# EAGLE design 9axis_ToF (EAGLE 9.7.0)
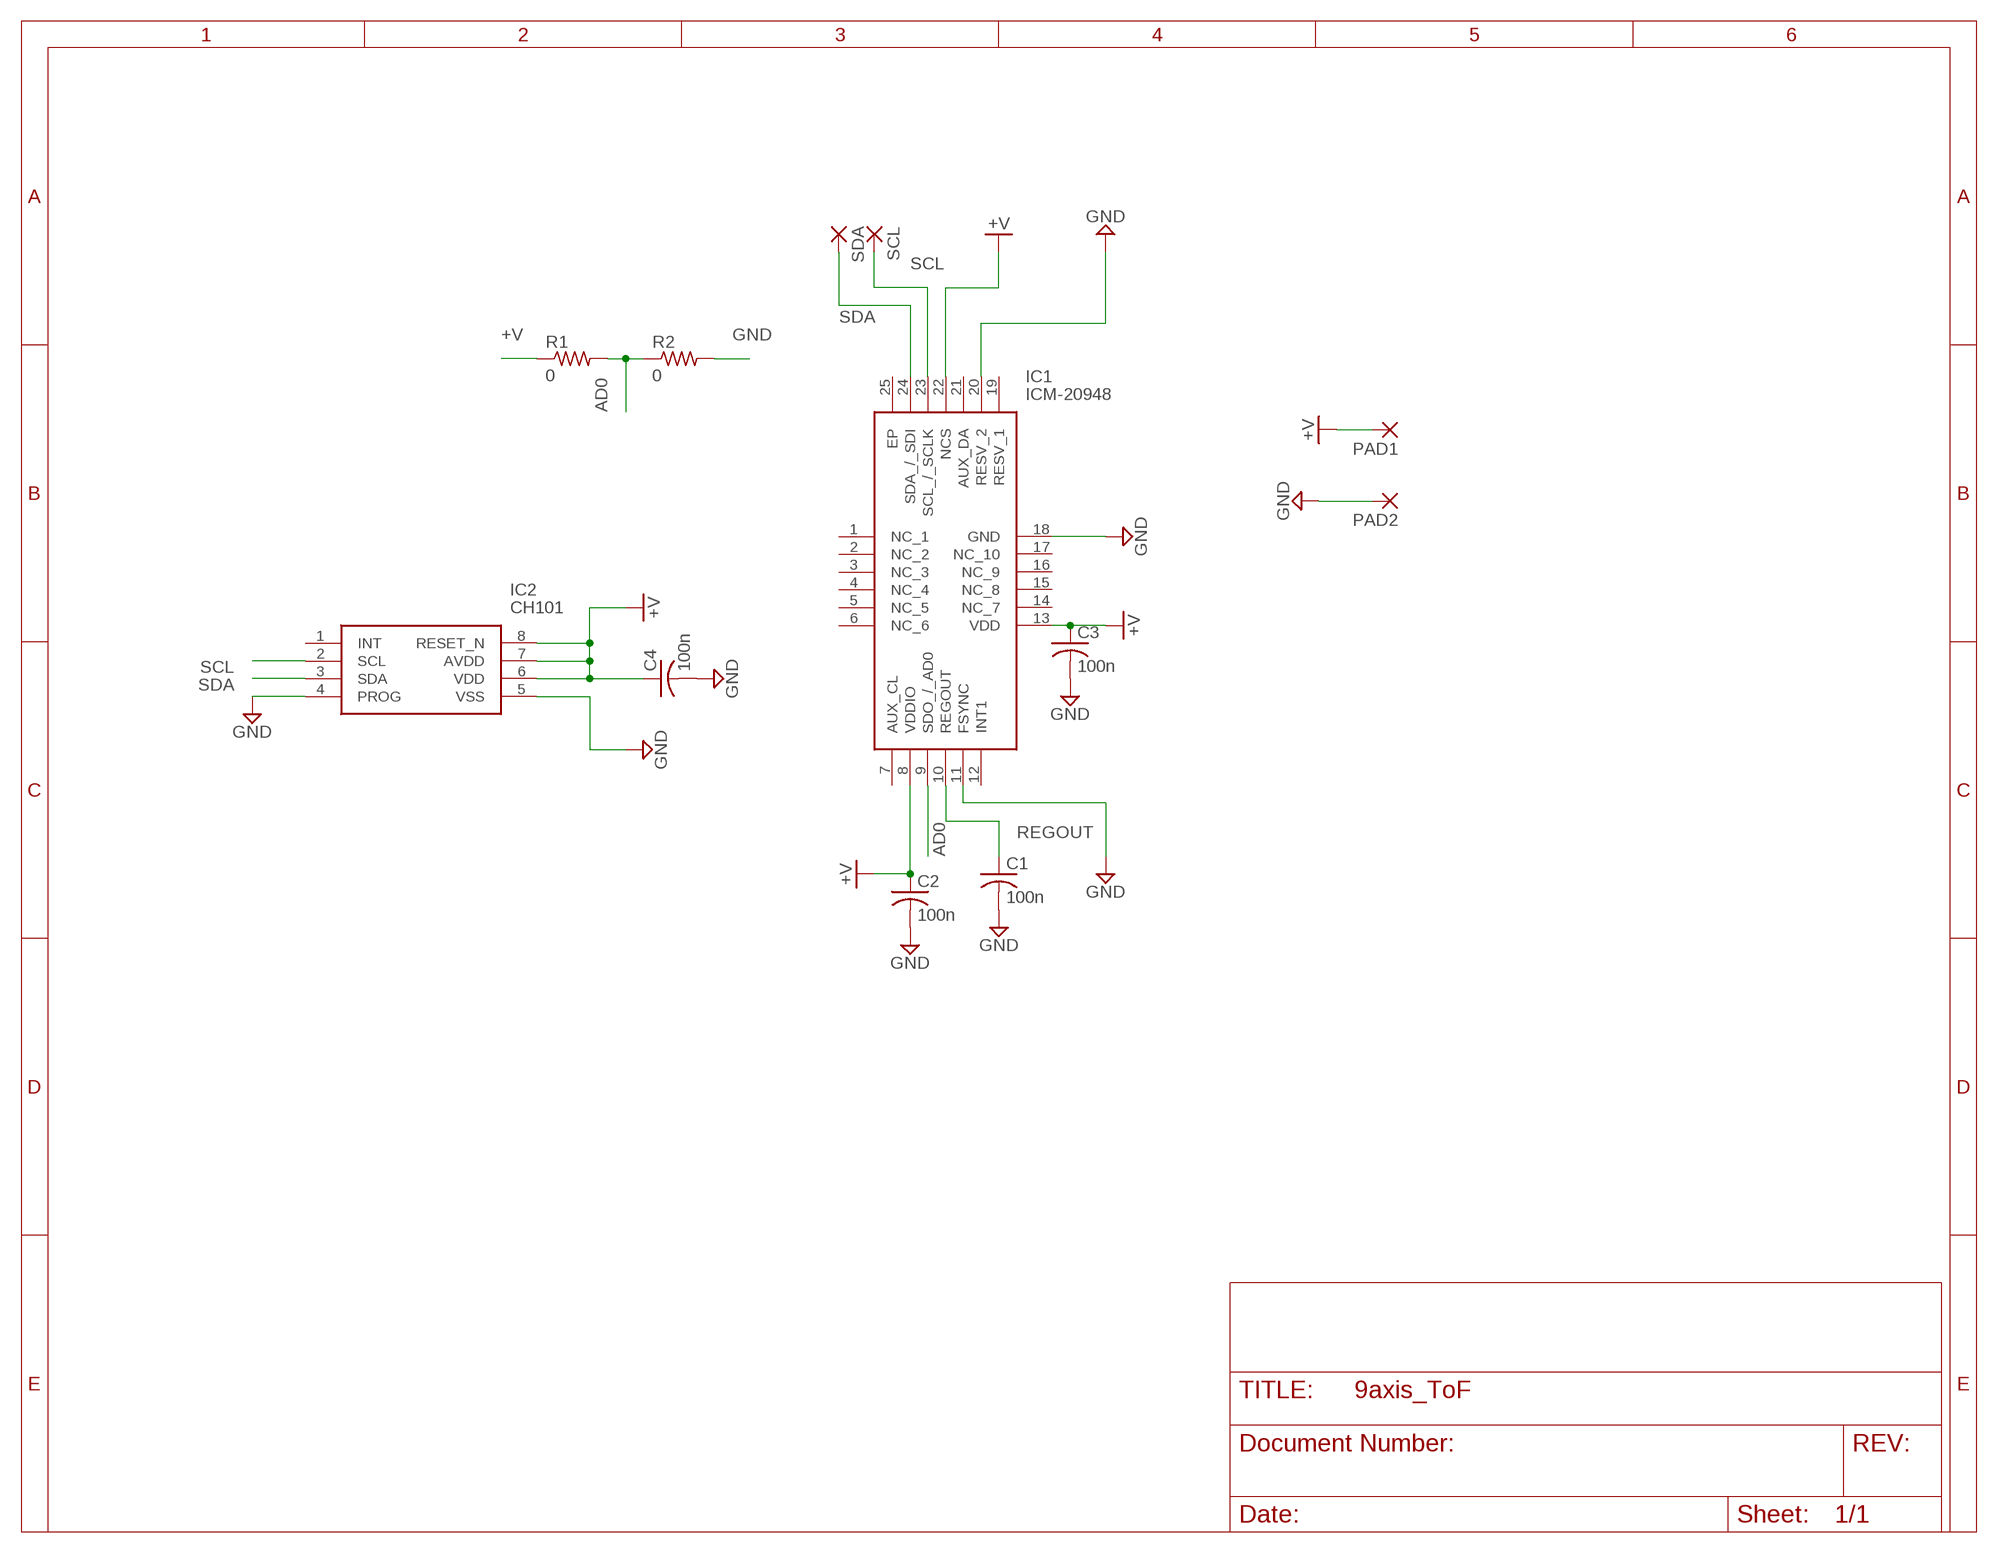
[diagram p0: schematic, sheet 1]

## Parts
C1  100n  C-USC0603  [C0603]
C2  100n  C-USC0603  [C0603]
C3  100n  C-USC0603  [C0603]
C4  100n  C-USC0603  [C0603]
IC1  ICM-20948  [QFN40P300X300X105-25N]
IC2  CH101  [CH101]
PAD1  SMD5  [SMD2,54-5,08]
PAD2  SMD5  [SMD2,54-5,08]
R1  0  R-US_R0603  [R0603]
R2  0  R-US_R0603  [R0603]
SCL  SMD5  [SMD2,54-5,08]
SDA  SMD5  [SMD2,54-5,08]

## Nets
+V [VDD]: C2.1 C3.1 C4.1 IC1.8(VDDIO) IC1.13(VDD) IC1.22(NCS) IC2.6(VDD) IC2.7(AVDD) IC2.8(RESET_N) PAD1.1(P) R1.1
AD0: IC1.9(SDO_/_AD0) R1.2 R2.1
GND [GND]: C1.2 C2.2 C3.2 C4.2 IC1.11(FSYNC) IC1.18(GND) IC1.20(RESV_2) IC2.4(PROG) IC2.5(VSS) PAD2.1(P) R2.2
REGOUT: C1.1 IC1.10(REGOUT)
SCL: IC1.23(SCL_/_SCLK) IC2.2(SCL) SCL.1(P)
SDA: IC1.24(SDA_/_SDI) IC2.3(SDA) SDA.1(P)
Unconnected: IC1.1(NC_1) IC1.2(NC_2) IC1.3(NC_3) IC1.4(NC_4) IC1.5(NC_5) IC1.6(NC_6) IC1.7(AUX_CL) IC1.12(INT1) IC1.14(NC_7) IC1.15(NC_8) IC1.16(NC_9) IC1.17(NC_10) IC1.19(RESV_1) IC1.21(AUX_DA) IC1.25(EP) IC2.1(INT)

## Library data of the parts
C1-C4 = rcl:C-US: CAPACITOR, American symbol; SPICEPREFIX: C
IC1 = ICM-20948:ICM-20948: IMUs - Inertial Measurement Units World's Lowest Power 9-Axis MEMS MotionTracking Device Source: Datasheet <https://product.tdk.com/system/files/dam/doc/product/sensor/mortion-inertial/imu/data_sheet/ds-000189-icm-20948-v1.3.pdf>; ARROW_PART_NUMBER: ICM-20948; ARROW_PRICE-STOCK: https://www.arrow.com/en/products/icm-20948/invensense?region=nac; DESCRIPTION: IMUs - Inertial Measurement Units World's Lowest Power 9-Axis MEMS MotionTracking Device; HEIGHT: 1.05mm; MANUFACTURER_NAME: TDK; MANUFACTURER_PART_NUMBER: ICM-20948; MOUSER_PART_NUMBER: 410-ICM-20948; MOUSER_PRICE-STOCK: https://www.mouser.co.uk/ProductDetail/TDK-InvenSense/ICM-20948?qs=u4fy%2FsgLU9OtGc31yF%2Friw%3D%3D
IC2 = CH101:CH101: Ultrasonic ToF (Time-of-Flight) Sensors, Operating Range=4cm to 1.2m, Current Consumption=13?A (1 sample/sec:10cm max range) Source: Datasheet <https://3cfeqx1hf82y3xcoull08ihx-wpengine.netdna-ssl.com/wp-content/uploads/2021/01/DS-000331-CH101-v1.4.pdf>; DESCRIPTION: Ultrasonic ToF (Time-of-Flight) Sensors, Operating Range=4cm to 1.2m, Current Consumption=13?A (1 sample/sec:10cm max range); HEIGHT: 1.36mm; MANUFACTURER_NAME: TDK; MANUFACTURER_PART_NUMBER: CH101
PAD1 PAD2 SCL SDA = wirepad:SMD5: SMD PAD
R1 R2 = rcl:R-US_: RESISTOR, American symbol; SPICEPREFIX: R

## Net classes
0 default: width 0.203 mm
1 GND: width 0.203 mm
2 VDD: width 0.203 mm, clearance 0.152 mm to class 0, clearance 0.305 mm to class 1, clearance 0.152 mm

## Board
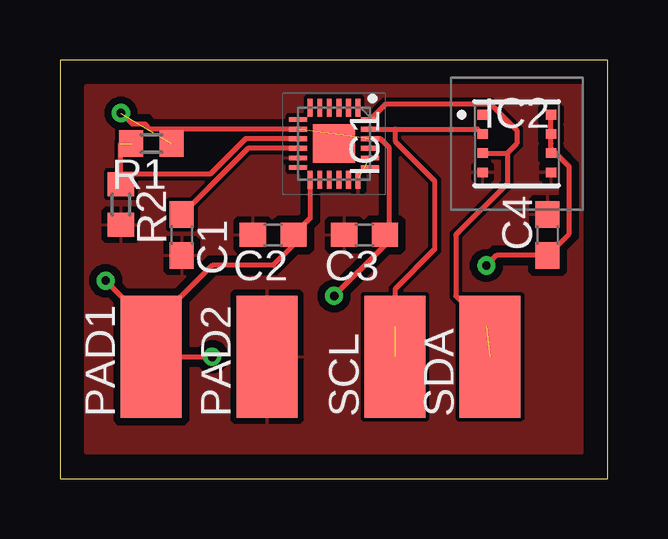
[diagram p1: board, top side]
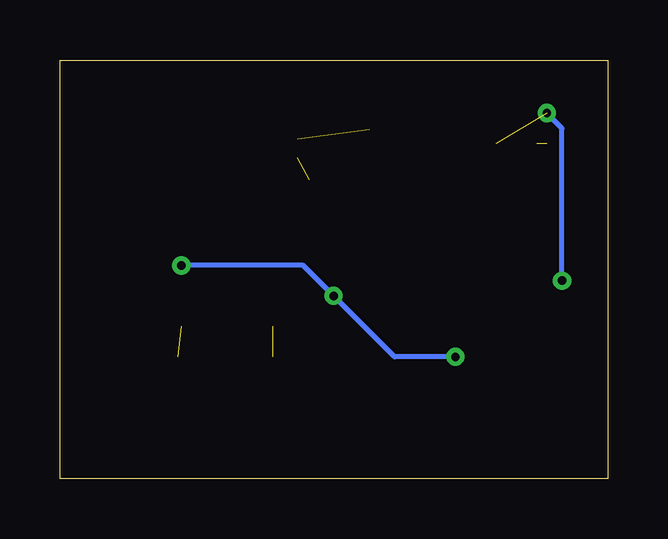
[diagram p2: board, bottom side, seen from below]

Size 22.84 x 17.45 mm. Coordinates in mm from the lower left corner, seen from the top.
Outline: 0,0 22.84,0 22.84,17.45 0,17.45 0,0
Copper layers (1*16): Top / Bottom
Stack-up Default Layer Stack: Top User Defined 0.035mm / Dielectric-1 User Defined 1.5mm / Bottom User Defined 0.035mm
Design rules "default *": minimum track width 8mil, minimum drill 0.35mm, track to track 6mil, track to pad 6mil, pad to pad 6mil, via to via 6mil, smd to smd 6mil, copper to edge 40mil, drill to drill 6mil, minimum pad ring 10mil, minimum via ring 8mil, stop-mask expansion 4mil, vias tented up to drill 0mil, thermal gap 10mil

### Footprints (pad centres in the part's own frame; a part is rotated, then mirrored left to right if it is on the bottom)
C0603 = smd 1.1 x 1: 1 -0.85,0; 2 0.85,0
QFN40P300X300X105-25N = smd 0.75 x 0.2: 1 -1.5,1; 2 -1.5,0.6; 3 -1.5,0.2; 4 -1.5,-0.2; 5 -1.5,-0.6; 6 -1.5,-1; 13 1.5,-1; 14 1.5,-0.6; 15 1.5,-0.2; 16 1.5,0.2; 17 1.5,0.6; 18 1.5,1 | smd 0.2 x 0.75: 7 -1,-1.5; 8 -0.6,-1.5; 9 -0.2,-1.5; 10 0.2,-1.5; 11 0.6,-1.5; 12 1,-1.5; 19 1,1.5; 20 0.6,1.5; 21 0.2,1.5; 22 -0.2,1.5; 23 -0.6,1.5; 24 -1,1.5 | smd 1.59 x 1.75: 25 0,0
CH101 = smd 0.45 x 0.4: 1 -1.425,1.2; 2 -1.425,0.4; 3 -1.425,-0.4; 4 -1.425,-1.2; 5 1.425,-1.2; 6 1.425,-0.4; 7 1.425,0.4; 8 1.425,1.2
SMD2,54-5,08 = smd 2.54 x 5.08: 1 0,0
R0603 = smd 1 x 1.1: 1 -0.85,0; 2 0.85,0

### Placement (x,y rotation side)
C1  5.08,10.16 270 top
C2  8.89,10.16 180 top
C3  12.7,10.16 180 top
C4  20.33,10.16 90 top
IC1  11.43,13.97 270 top
IC2  19.05,13.97 0 top
PAD1  3.81,5.08 0 top
PAD2  8.64,5.08 0 top
R1  3.81,13.97 180 top
R2  2.54,11.43 270 top
SCL  13.97,5.08 0 top
SDA  17.93,5.08 0 top

### Tracks (layer width: path | path; a pad name or v marks a point on that pad's centre or on a via)
+V  (via drill 0.35)  (2 unrouted)
  Top 0.203: IC2.6 20.48,13.77 | IC2.8 IC2.7 20.48,13.97 20.48,13.77 | IC1.13 10.43,10.85 C2.1 9.74,9.74 8.89,8.89 6.35,8.89 3.81,6.35 v1.9,8.26 | IC1.8 7.62,14.57 3.77,14.57 3.56,14.77 3.01,14.77 v2.54,15.24 | PAD1.1 v6.35,5.08 | v11.43,7.62 13.55,9.74 C3.1 13.97,10.16 13.71,10.42 13.71,13.82 13.36,14.17 IC1.22 | v17.78,8.89 18.2,9.31 C4.1 21.24,10.22 21.24,13.01 20.48,13.77
  Bottom 0.203: v1.9,8.26 1.9,14.61 v2.54,15.24 | v6.35,5.08 8.89,5.08 v11.43,7.62 12.7,8.89 v17.78,8.89
AD0  (1 unrouted)
  Top 0.203: R2.1 2.54,12.7 | 2.54,12.7 2.54,13.97 | 2.54,12.7 6.27,12.7 7.74,14.17 IC1.9
GND  (1 unrouted)
  pour Top: 0,0 22.86,0 22.86,17.78 0,17.78
REGOUT
  Top 0.203: C1.1 7.84,13.77 IC1.10
SCL  (1 unrouted)
  Top 0.203: IC1.23 13.97,14.57 | 13.97,14.57 17.43,14.57 IC2.2 | 13.97,14.57 13.97,14.07 15.62,12.41 15.62,9.55 13.97,7.9 13.97,6.35
SDA  (1 unrouted)
  Top 0.203: 18.65,13.57 19.05,13.97 19.05,14.53 17.96,15.62 13.97,15.62 13.58,15.62 IC1.24 | IC2.3 18.65,13.57 | 18.65,13.57 18.65,12.3 16.51,10.16 16.51,7.62 17.78,6.35